# EAGLE design ATTINY85 Updated Design Extended Board (EAGLE 8.4.0)
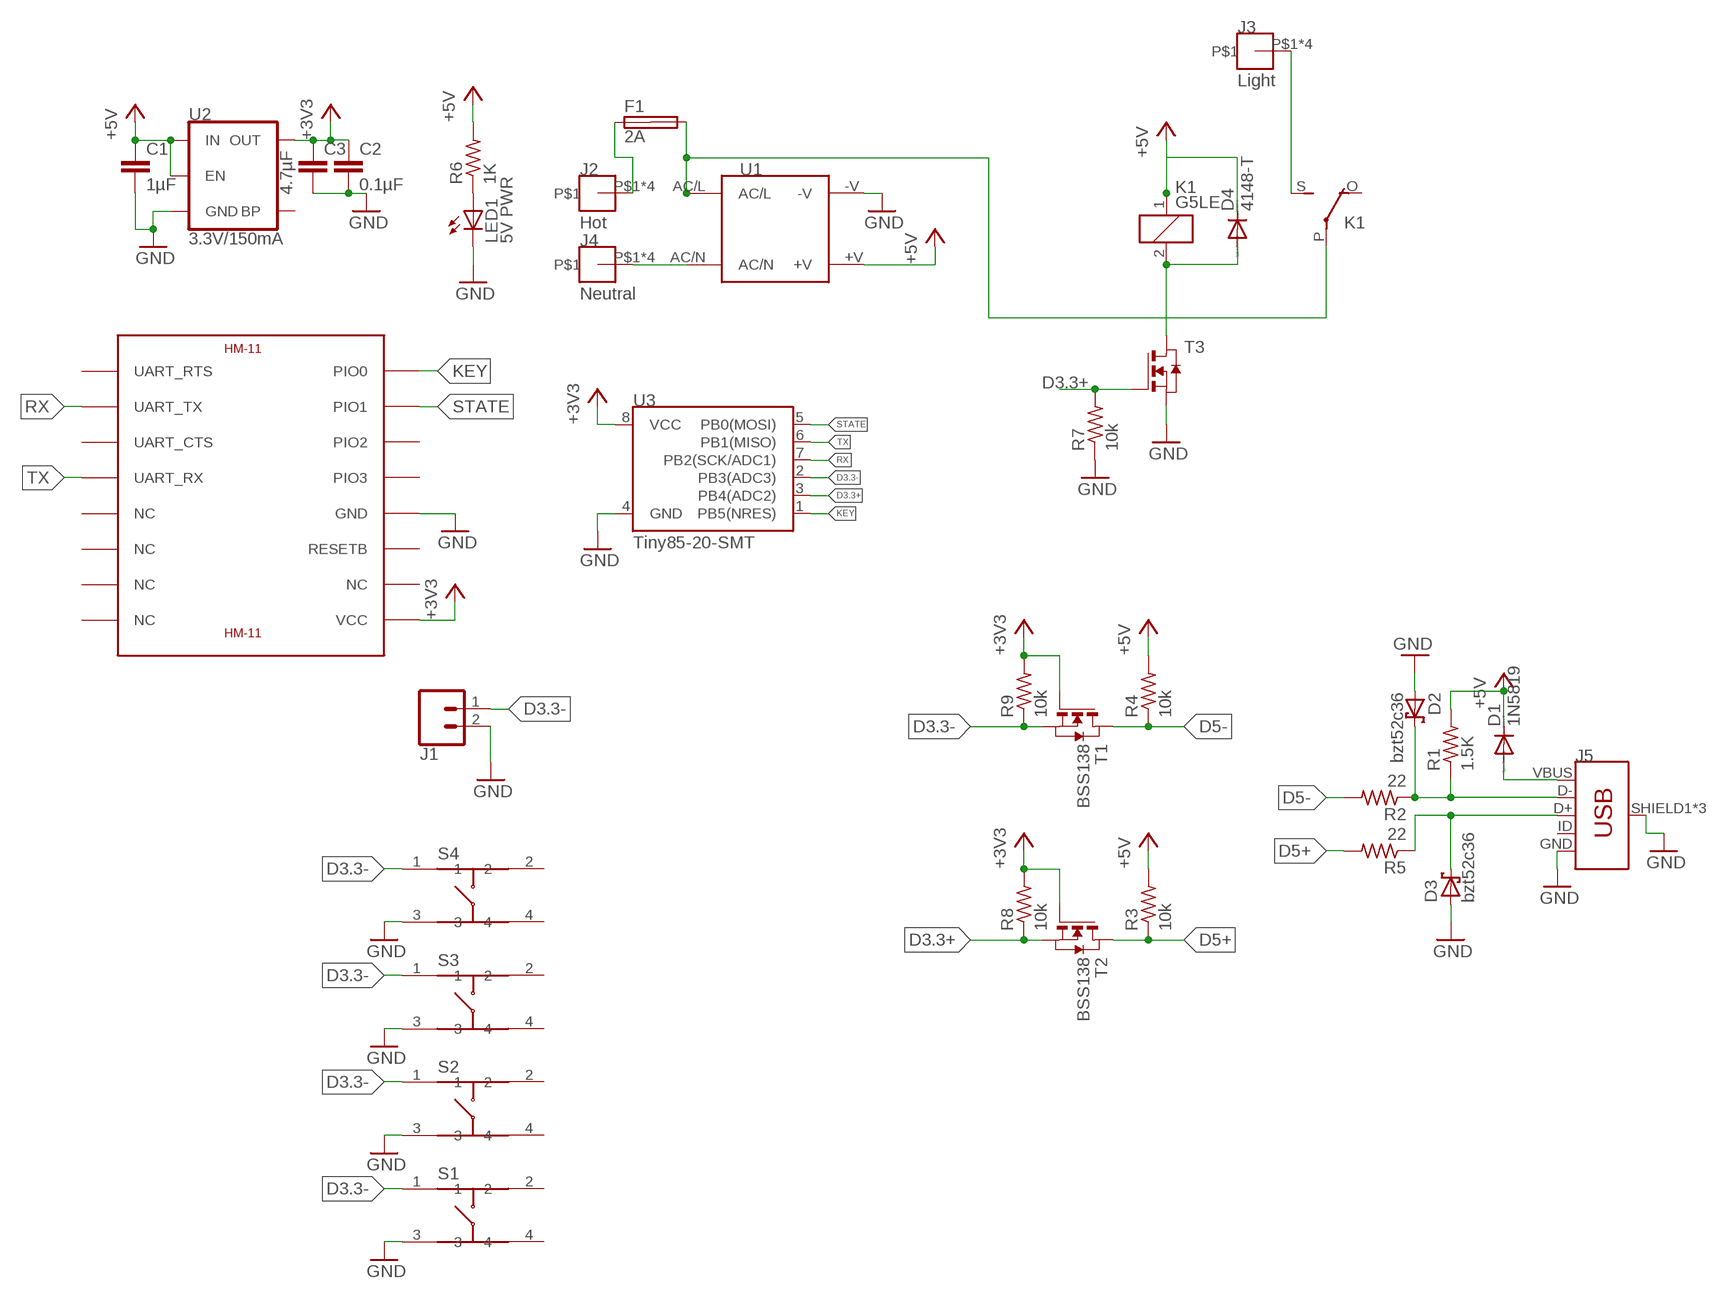
[diagram p0: schematic, sheet 1]

## Parts
C1  1µF  C-EUC0603K  [C0603K]
C2  0.1µF  C-EUC0603K  [C0603K]
C3  4.7µF  C-EUC0603K  [C0603K]
D1  1N5819  DIODE-SOD323-R  [SOD323-R]
D2  bzt52c36  BAT60J  [SOD323_ST]
D3  bzt52c36  BAT60J  [SOD323_ST]
D4  4148-T  DIODE-SOD80C  [SOD80C]
F1  2A  SHK20L  [SHK20L]
J1  CONN_025MM  [SCREWTERMINAL-5MM-2]
J2  Hot  7700  [7700]
J3  Light  7700  [7700]
J4  Neutral  7700  [7700]
J5  USB_MICRO-B_FEMALE-SMT  [USB-B-MICRO-SMD]
K1  G5LE  [G5LE]
LED1  5V PWR  LEDCHIPLED_0603  [CHIPLED_0603]
R1  1.5K  R-US_R0603  [R0603]
R2  22  R-US_R0603  [R0603]
R3  10k  R-US_R0603  [R0603]
R4  10k  R-US_R0603  [R0603]
R5  22  R-US_R0603  [R0603]
R6  1K  R-US_R0603  [R0603]
R7  10k  R-US_R0603  [R0603]
R8  10k  R-US_R0603  [R0603]
R9  10k  R-US_R0603  [R0603]
S1  PTS645S_SMTR92  [SMT]
S2  PTS645S_SMTR92  [SMT]
S3  PTS645S_SMTR92  [SMT]
S4  PTS645S_SMTR92  [SMT]
T1  BSS138  NMOSSOT23  [SOT-23]
T2  BSS138  NMOSSOT23  [SOT-23]
T3  NMOSSOT23  [SOT-23]
U1  IRM-05-5  [IRM-05]
U2  3.3V/150mA  V_REG_MIC52053.3V  [SOT23-5]
U3  Tiny85-20-SMT  ATTINY45TINY85-20-SMT  [SO08-EIAJ_MCU]
U$1  HM-11  [HM-11]

## Nets
+3V3: C2.1 C3.1 R8.2 R9.2 T1.3(G) T2.3(G) U2.5(OUT) U3.8(VCC) U$1.VCC
+5V: C1.1 D1.C D4.C K1.1 R1.2 R3.2 R4.2 R6.2 U1.+V U2.1(IN) U2.3(EN)
D3.3+: R7.2 R8.1 T2.2(S) T3.3(G) U3.3(PB4(ADC2))
D3.3-: J1.1 R9.1 S1.1 S2.1 S3.1 S4.1 T1.2(S) U3.2(PB3(ADC3))
D5+: R3.1 R5.2 T2.1(D)
D5-: R2.2 R4.1 T1.1(D)
GND: C1.2 C2.2 C3.2 D2.A D3.A J1.2 J5.GND J5.SHIELD1(SHIELD) J5.SHIELD2(SHIELD) J5.SHIELD3(SHIELD) LED1.C R7.1 S1.3 S2.3 S3.3 S4.3 T3.2(S) U1.-V U2.2(GND) U3.4(GND) U$1.GND
HOT [POWER]: F1.1A J2.P$1 J2.P$2 J2.P$3 J2.P$4
KEY: U3.1(PB5(NRES)) U$1.PIO0
LIGHT [POWER]: J3.P$1 J3.P$2 J3.P$3 J3.P$4 K1.S(2:S)
N$2: LED1.A R6.1
N$4 [POWER]: F1.2A K1.P(2:P) U1.AC/L
N$8: D4.A K1.2 T3.1(D)
N$16: D1.A J5.VBUS
N$17: D2.C J5.D- R1.1 R2.1
N$18: D3.C J5.D+ R5.1
NEUTRAL [POWER]: J4.P$1 J4.P$2 J4.P$3 J4.P$4 U1.AC/N
RX: U3.7(PB2(SCK/ADC1)) U$1.UART_TX
STATE: U3.5(PB0(MOSI)) U$1.PIO1
TX: U3.6(PB1(MISO)) U$1.UART_RX
Unconnected: F1.1B F1.2B J5.ID K1.O(2:O) S1.2 S1.4 S2.2 S2.4 S3.2 S3.4 S4.2 S4.4 U2.4(BP) U$1.NC@5(NC) U$1.NC@6(NC) U$1.NC@7(NC) U$1.NC@8(NC) U$1.NC@10(NC) U$1.PIO2 U$1.PIO3 U$1.RESETB U$1.UART_CTS U$1.UART_RTS

## Library data of the parts
C1-C3 = rcl:C-EU: CAPACITOR, European symbol
D1 D4 = diode:DIODE-: DIODE
D2 D3 = diode:BAT60J: Schottky barrier diode Source: www.st.com, BAT60J.pdf
F1 = fuse:SHK20L: FUSE HOLDER 5 x 20 mm, SH contact, SHH1 Schukat, E1073 Buerklin; OC_FARNELL: unknown; OC_NEWARK: unknown
J1 = SparkFun-Connectors:CONN_02: Multi connection point. Often used as Generic Header-pin footprint for 0.1 inch spaced/style header connections On any of the 0.1 inch spaced packages, you can populate with these: Break Away Headers - Straight <https://www.sparkfun.com/products/116> (PRT-00116) Break Away Male Headers - Right Angle <https://www.sparkfun.com/products/553> (PRT-00553) Female Headers <https://www.sparkfun.com/products/115> (PRT-00115) Break Away Headers - Machine Pin <https://www.sparkfun.com/products/117> (PRT-00117) Break Away Female Headers - Swiss Machine Pin <https://www.sparkfun.com/products/743> (PRT-00743) For SCREWTERMINALS and SPRING TERMINALS visit here: Screw Terimnals on SparkFun.com <https://www.sparkfun.com/search/results?term=Screw+Terminals> (5mm/3.5mm/2.54mm spacing) This device is also useful as a general connection point to wire up your design to another part of your project. Our various solder wires solder well into these plated through hole pads. Hook-Up Wire - Assortment (Stranded, 22 AWG) <https://www.sparkfun.com/products/11375> (PRT-11375) Hook-Up Wire - Assortment (Solid Core, 22 AWG) <https://www.sparkfun.com/products/11367> (PRT-11367) View the entire wire category on our website here <https://www.sparkfun.com/categories/141> Special notes: Molex polarized connector foot print use with: PRT-08233 with associated crimp pins and housings. 2.54_SCREWTERM for use with PRT-10571. 3.5mm Screw Terminal footprints for PRT-08084 5mm Screw Terminal footprints for use with PRT-08432; SF_SKU: PRT-08432
J2-J4 = Screw Terminal Keystone 7700:7700: 15A Screw Terminal Keystone 7700 <http://www.keyelco.com/product.cfm/Horizontal-Screw-Terminals/7700/product_id/1371>
J5 = SparkFun-Connectors_Custom_USB:USB_MICRO-B: USB Type Micro-B Connector Male/female and PTH/SMT variants SparkFun Products: SparkFun microB USB Breakout <https://www.sparkfun.com/products/12035> SparkFun USB microB Plug Breakout <https://www.sparkfun.com/products/10031> SparkFun ESP8266 Thing <https://www.sparkfun.com/products/13231>; PROD_ID: CONN-11752
K1 = relay:G5LE: RELAY 1 x switch, 10 A/120 V AC, 8 A/30 V DC, Omron; OC_FARNELL: unknown; OC_NEWARK: unknown
LED1 = led:LED: LED OSRAM: - CHIPLED LG R971, LG N971, LY N971, LG Q971, LY Q971, LO R971, LY R971 LH N974, LH R974 LS Q976, LO Q976, LY Q976 LO Q996 - Hyper CHIPLED LW Q18S LB Q993, LB Q99A, LB R99A - SideLED LS A670, LO A670, LY A670, LG A670, LP A670 LB A673, LV A673, LT A673, LW A673 LH A674 LY A675 LS A676, LA A676, LO A676, LY A676, LW A676 LS A679, LY A679, LG A679 - Hyper Micro SIDELED® LS Y876, LA Y876, LO Y876, LY Y876 LT Y87S - SmartLED LW L88C, LW L88S LB L89C, LB L89S, LG L890 LS L89K, LO L89K, LY L89K LS L896, LA L896, LO L896, LY L896 - TOPLED LS T670, LO T670, LY T670, LG T670, LP T670 LSG T670, LSP T670, LSY T670, LOP T670, LYG T670 LG T671, LOG T671, LSG T671 LB T673, LV T673, LT T673, LW T673 LH T674 LS T676, LA T676, LO T676, LY T676, LB T676, LH T676, LSB T676, LW T676 LB T67C, LV T67C, LT T67C, LS T67K, LO T67K, LY T67K, LW E67C LS E67B, LA E67B, LO E67B, LY E67B, LB E67C, LV E67C, LT E67C LW T67C LS T679, LY T679, LG T679 LS T770, LO T770, LY T770, LG T770, LP T770 LB T773, LV T773, LT T773, LW T773 LH T774 LS E675, LA E675, LY E675, LS T675 LS T776, LA T776, LO T776, LY T776, LB T776 LHGB T686 LT T68C, LB T68C - Hyper Mini TOPLED® LB M676 - Mini TOPLED Santana® LG M470 LS M47K, LO M47K, LY M47K Source: http://www.osram.convergy.de LUXEON: - LUMILED® LXK2-PW12-R00, LXK2-PW12-S00, LXK2-PW14-U00, LXK2-PW14-V00 LXK2-PM12-R00, LXK2-PM12-S00, LXK2-PM14-U00 LXK2-PE12-Q00, LXK2-PE12-R00, LXK2-PE12-S00, LXK2-PE14-T00, LXK2-PE14-U00 LXK2-PB12-K00, LXK2-PB12-L00, LXK2-PB12-M00, LXK2-PB14-N00, LXK2-PB14-P00, LXK2-PB14-Q00 LXK2-PR12-L00, LXK2-PR12-M00, LXK2-PR14-Q00, LXK2-PR14-R00 LXK2-PD12-Q00, LXK2-PD12-R00, LXK2-PD12-S00 LXK2-PH12-R00, LXK2-PH12-S00 LXK2-PL12-P00, LXK2-PL12-Q00, LXK2-PL12-R00 Source: www.luxeon.com KINGBRIGHT: KA-3528ASYC Source: www.kingbright.com
R1-R9 = resistor:R-US_: RESISTOR, American symbol
S1-S4 = PTS645 Series Tactile Switches:PTS645S_SMTR92: Surface Mount PTS645 Series Switch Datasheet <http://www.mouser.com/ds/2/60/-1131575.pdf>
T1-T3 = zetex:NMOSSOT23: MOS FET; OC_FARNELL: unknown; OC_NEWARK: unknown
U1 = IRM-05:IRM-05-5: IRM-05-5 AC to 5VDC Specifications: Manufacturer: Mean Well Input Voltage: 85~264 VAC 120~370 VDC Input Frequency: 47~440 Hz Output Voltage: 5 V Output Current: 1 A IRM-05 Datasheet <http://www.mouser.com/ds/2/260/IRM-05-SPEC-806200.pdf>
U2 = SparkFun-IC-Power:V_REG_MIC5205: V_REG MIC5205 Standard 3.3V, 5V, and Adjustable 150mA LDO voltage regulator in SOT-23 layout. Micrel part MIC5205. BP (by-pass) pin is used to lower output noise with 470pF cap, may be left open. On the adjustable version BP is used to set output.; PROD_ID: VREG-00822
U3 = SparkFun-Retired:ATTINY45: Atmel 8-pin 2/4/8kB flash uC Retired; PROD_ID: IC-09092
U$1 = hm-11:HM-11: JNHuaMao HM-11 Bluetooth 4.0 Transceiver based on TI CC2540/CC2541

## Net classes
0 default: clearance 0.152 mm
1 POWER: width 1.397 mm, clearance 1.27 mm

## Board
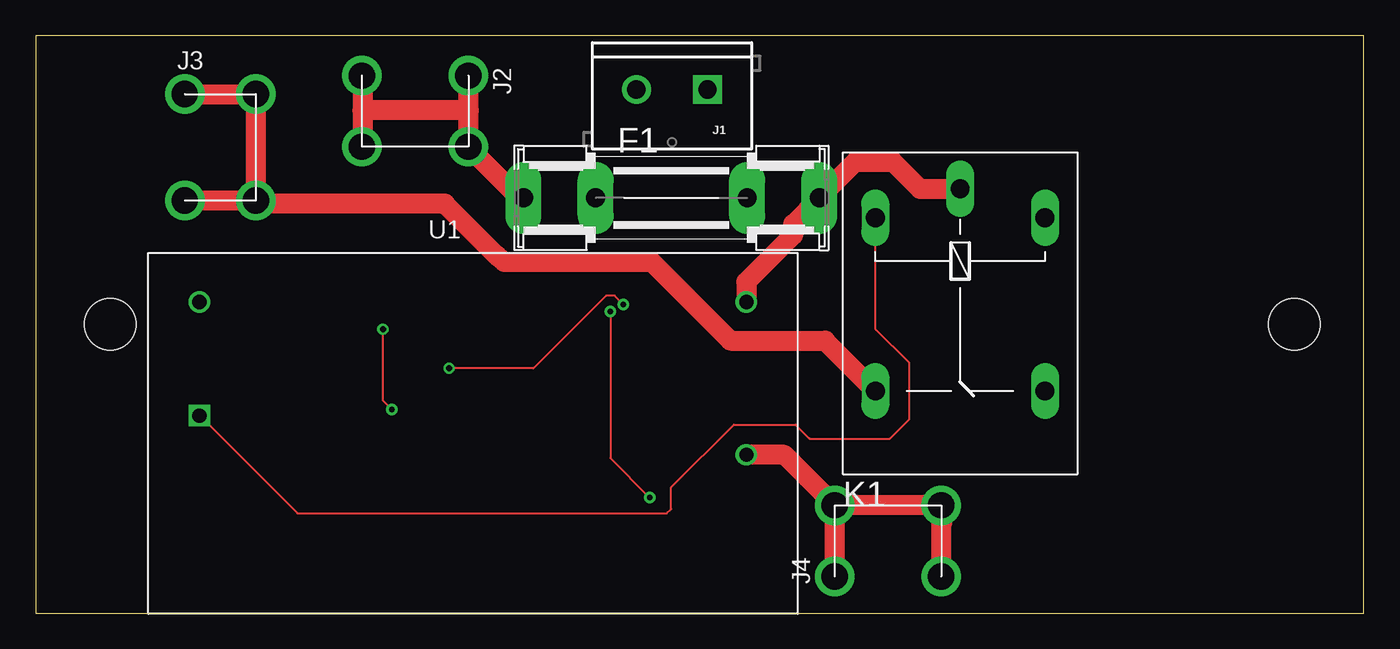
[diagram p1: board, top side]
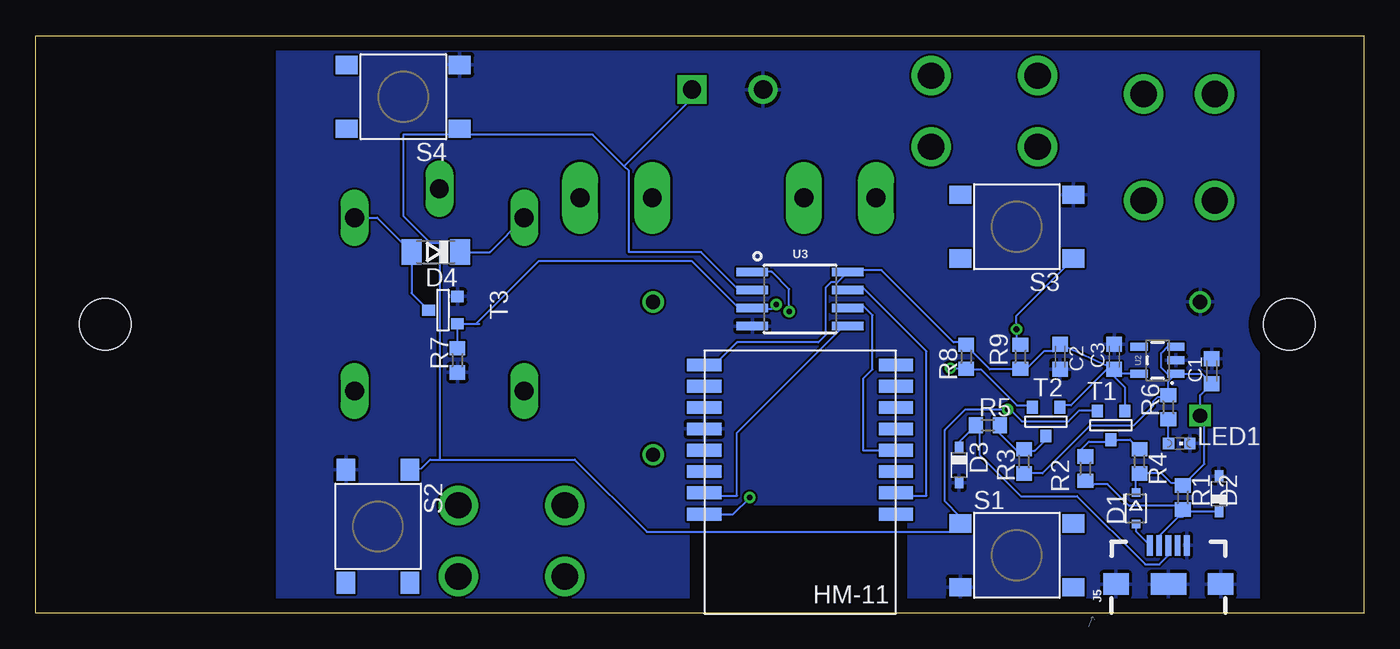
[diagram p2: board, bottom side, seen from below]

Size 93.5 x 40.63 mm. Coordinates in mm from the lower left corner, seen from the top.
Outline: 0,0 93.5,0 93.5,40.63 0,40.63 0,0
Copper layers (1*16): Top 0.035mm / dielectric 1.5mm / Bottom 0.035mm
Design rules "default *": minimum track width 6mil, minimum drill 0.4mm, track to track 6mil, track to pad 6mil, pad to pad 6mil, via to via 6mil, smd to smd 6mil, copper to edge 40mil, drill to drill 6mil, minimum pad ring 10mil, minimum via ring 8mil, stop-mask expansion 4mil, vias tented up to drill 0mil, thermal gap 10mil
Holes 3.66 mm at 88.6,20.32 5.26,20.32

### Footprints (pad centres in the part's own frame; a part is rotated, then mirrored left to right if it is on the bottom)
C0603K = smd 1.05 x 1.08: 1 -0.875,0; 2 0.875,0
SOD323-R = smd 0.6 x 0.6: A 1.1,0; C -1.1,0
SOD323_ST = smd 0.8 x 0.6: A 1.25,0; C -1.25,0
SOD80C = smd 1.4 x 1.8: A 1.7,0; C -1.7,0
SHK20L = drill 1.321 pad 2.54 long: 1A -10.414,0; 1B -5.334,0; 2A 10.414,0; 2B 5.334,0
SCREWTERMINAL-5MM-2 = drill 1.3 pad 2.032 square: 1 0,0 | drill 1.3 pad 2.032: 2 5,0
7700 = drill 1.85: P$1 -2.5,3.745; P$2 2.5,3.745; P$3 -2.5,-3.745; P$4 2.5,-3.745
USB-B-MICRO-SMD = smd 1.45 x 0.4: D+ 2.725,0; D- 2.725,0.65; GND 2.725,-1.3; ID 2.725,-0.65; VBUS 2.725,1.3 | smd 1.5 x 1.8: SHIELD1 0,3.685; SHIELD2 0,-3.685 | smd 1.5 x 2.5: SHIELD3 0,0
G5LE = drill 1.321 long: 1 -7.493,-5.969; 2 -7.493,5.969; O 4.699,5.969; P -9.525,0; S 4.699,-5.969
CHIPLED_0603 = smd 0.8 x 0.8: A 0,-0.75; C 0,0.75
R0603 = smd 1 x 1.1: 1 -0.85,0; 2 0.85,0
SMT = smd 1.55 x 1.3: 1 -3.975,2.25; 2 3.975,2.25; 3 -3.975,-2.25; 4 3.975,-2.25
SOT-23 = smd 0.787 x 0.889: 1 0.025,-1.016; 2 -0.94,1.016; 3 0.991,1.016
IRM-05 = drill 1 square: +V -19.25,-2.625 | drill 1: -V -19.25,5.375; AC/L 19.25,5.375; AC/N 19.25,-5.375
SOT23-5 = smd 0.55 x 1.2: 1 -0.95,-1.3; 2 0,-1.3; 3 0.95,-1.3; 4 0.95,1.3; 5 -0.95,1.3
SO08-EIAJ_MCU = smd 0.61 x 2.21: 1 -1.905,-3.378; 2 -0.635,-3.378; 3 0.635,-3.378; 4 1.905,-3.378; 5 1.905,3.353; 6 0.635,3.353; 7 -0.635,3.353; 8 -1.905,3.353
HM-11 = smd 2.4 x 0.9: GND 6.5,0; NC@5 -7,0; NC@6 -7,-1.5; NC@7 -7,-3; NC@8 -7,-4.5; NC@10 6.5,-3; PIO0 6.5,6; PIO1 6.5,4.5; PIO2 6.5,3; PIO3 6.5,1.5; RESETB 6.5,-1.5; UART_CTS -7,3; UART_RTS -7,6; UART_RX -7,1.5; UART_TX -7,4.5; VCC 6.5,-4.5

### Placement (x,y rotation side)
C1  10.72,17.02 90 bottom
C2  21.39,18.03 270 bottom
C3  17.58,18.03 90 bottom
D1  16.05,7.37 270 bottom
D2  10.21,8.38 90 bottom
D3  28.5,10.41 270 bottom
D4  65.33,25.4 180 bottom
F1  44.75,29.21 0 top
J1  47.29,36.83 180 top
J2  26.72,35.31 270 top
J3  13,32.77 0 top
J4  59.99,5.08 90 top
J5  13.77,2.03 90 bottom
K1  65.07,20.32 270 top
LED1  13,11.94 270 bottom
R1  12.75,8.13 90 bottom
R2  19.61,10.16 90 bottom
R3  23.93,10.67 270 bottom
R4  15.8,10.67 270 bottom
R5  26.47,13.21 0 bottom
R6  13.77,14.48 90 bottom
R7  63.8,17.78 90 bottom
R8  27.99,18.03 90 bottom
R9  24.18,18.03 270 bottom
S1  24.43,4.06 0 bottom
S2  69.39,6.1 270 bottom
S3  24.43,27.18 180 bottom
S4  67.61,36.32 180 bottom
T1  17.83,13.21 0 bottom
T2  22.4,13.46 0 bottom
T3  64.82,21.34 270 bottom
U1  30.78,16.51 0 top
U2  14.53,17.78 90 bottom
U3  39.67,22.1 270 bottom
U$1  39.93,12.95 180 bottom

### Tracks (layer width: path | path; a pad name or v marks a point on that pad's centre or on a via)
+3V3
  Bottom 0.152: U2.5 17.25,16.83 C3.1 | C3.1 C2.1 21.89,18.41 22.53,18.41 23.8,17.14 R9.2 24.43,17.14 26.34,17.14 27.61,18.41 R8.2 28.24,19.05 28.88,19.05 33.96,24.13 35.86,24.13 U3.8 | 18.08,17.14 16.81,15.88 16.81,14.61 T1.3 | 18.08,17.14 20.62,14.61 21.26,14.61 T2.3 | 18.08,17.14 C3.1 | 37.13,24.13 36.5,24.13 U3.8 | U$1.VCC 46.02,17.78 45.39,17.78 44.12,19.05 38.4,19.05 37.9,19.56 37.9,22.89 37.52,23.27 37.06,23.27 U3.8
+5V
  Top 0.152: K1.1 59.13,27.81 59.13,19.96 61.49,17.6 61.49,13.64 60.12,12.27 54.48,12.27 53.49,13.26 49.15,13.26 44.73,8.84 44.73,7.32 44.42,7.01 18.44,7.01 11.58,13.87 U1.+V
  Bottom 0.152: D4.C 61.52,25.4 K1.1 | U2.1 11.41,16.83 C1.1 11.53,15.33 U1.+V 11.23,13.58 11.23,10.5 R1.2 12.8,8.99 12.95,9.14 13.56,9.14 14.25,9.83 15.77,9.83 R4.2 15.85,9.75 16.08,9.53 16.08,8.53 D1.C | U2.1 13.83,16.83 14.27,17.27 14.27,18.29 13.77,18.8 13.29,18.8 U2.3 | U2.1 13.77,16.29 R6.2 13.79,15.32 13.94,15.16 14.55,15.16 14.86,14.86 14.86,14.55 16.23,13.18 19.28,13.18 22.63,9.83 R3.2
D3.3+  (via drill 0.4)
  Top 0.152: v29.11,17.22 35.05,17.22 40.16,22.33 40.77,22.33 v41.38,21.72
  Bottom 0.152: R7.2 T3.3 62.53,20.34 | 62.53,20.34 62.26,20.34 | T2.2 23.16,14.61 24.43,14.61 26.97,17.14 27.61,17.14 R8.1 28.04,17.22 v29.11,17.22 | 44.12,21.59 47.29,24.77 58.09,24.77 62.53,20.32 62.53,20.34 | 44.12,21.59 43.48,21.59 U3.3 | 44.12,21.59 U3.3 | v41.38,21.72 41.68,21.41 43.05,21.41 U3.3
D3.3-  (via drill 0.4)
  Top 0.152: v24.46,19.96 24.46,14.94 v25.07,14.33
  Bottom 0.152: 65.07,10.79 65.71,10.79 66.34,10.16 S2.1 | 65.07,10.79 55.55,10.79 50.47,5.71 28.88,5.71 S1.1 28.42,6.33 28.42,6.78 29.49,7.85 29.49,12.88 28.04,14.33 v25.07,14.33 24.99,14.4 24.08,13.49 20.8,13.49 20.04,14.25 18.82,14.25 T1.2 18.72,14.29 | R9.1 24.43,19.05 24.43,19.96 v24.46,19.96 24.46,20.93 S3.1 | 52.07,31.45 51.74,31.11 51.74,25.4 46.66,25.4 44.12,22.86 43.48,22.86 U3.2 42.85,22.86 | 52.07,31.45 54.28,33.66 63.17,33.66 S4.1 63.8,33.66 67.61,33.66 67.61,27.94 65.71,26.04 65.07,26.04 65.07,10.79 | 52.07,31.45 47.32,36.2 47.32,36.8 J1.1
D5+
  Bottom 0.152: T2.1 22.53,12.06 23.16,11.43 23.8,11.43 R3.1 24.43,11.43 25.7,12.7 R5.2
D5-
  Bottom 0.152: T1.1 18.08,12.06 19.35,12.06 19.99,11.43 R2.2 | 15.54,11.43 R4.1 16.47,12.19 T1.1 | 17.45,12.06 T1.1
GND
  pour Bottom: 75.49,41.91 7.92,41.91 7.42,40.39 7.42,-0.25 7.67,-1.52 31.8,-1.52 32.05,-1.27 32.05,7.62 47.29,7.62 47.55,7.37 47.55,-1.27 73.96,-1.27 74.98,-0.25 75.49,-0.25 76.5,0.76 76.5,41.4 76,41.4
HOT
  Top 1.397: 23.01,35.36 23.01,37.8 J2.P$3 | 23.01,35.36 23.01,32.84 J2.P$4 | F1.1A 34.29,29.26 33.98,29.26 30.48,32.77 J2.P$2 30.48,33.45 30.48,35.36 | 30.48,35.36 30.48,37.8 J2.P$1 | 30.48,35.36 23.01,35.36
KEY  (via drill 0.4)
  Top 0.152: v43.23,8.13 40.46,10.9 v40.46,21.21
  Bottom 0.152: 46.02,6.99 U$1.PIO0 44.4,6.95 v43.23,8.13 | U3.1 41.68,24 40.46,22.78 v40.46,21.21
LIGHT
  Top 1.397: J3.P$4 J3.P$3 | J3.P$1 J3.P$2 J3.P$4 | K1.S 55.56,19.16 48.91,19.16 43.37,24.7 33,24.7 32.46,25.15 28.8,28.8 16.15,28.8 J3.P$4
N$2
  Bottom 0.152: LED1.A 13.75,13.62 R6.1
N$4
  Top 1.397: U1.AC/L 50.03,23.31 53.33,26.6 53.33,27.37 F1.2A 57.72,31.76 60.33,31.76 62.25,29.84 K1.P
N$8
  Bottom 0.152: K1.2 69.44,27.81 D4.A 67.03,22.5 T3.1
N$16
  Bottom 0.152: D1.A 16.05,5.74 J5.VBUS
N$17
  Bottom 0.152: 19.35,8.89 R2.1 19.35,8.99 19.05,8.99 18.97,9.07 18.06,9.07 16.54,7.54 13.03,7.54 12.8,7.32 R1.1 | D2.C 10.21,7.16 12.65,7.16 12.73,7.24 R1.1 | R1.1 12.73,7.16 12.73,6.78 13.08,6.78 14.42,5.45 J5.D-
N$18
  Bottom 0.152: D3.C 28.48,11.66 28.24,11.43 D3.C | D3.C 28.26,11.66 | R5.1 27.61,12.7 | D3.C 28.5,12.03 R5.1 | R5.1 27.36,13.03 27.05,12.72 27.05,11.12 24.16,8.23 20.19,8.23 15.39,3.43 14.4,3.43 13.77,4.06 J5.D+
NEUTRAL
  Top 1.397: J4.P$2 52.69,11.13 U1.AC/N | J4.P$2 J4.P$4 63.8,7.51 63.8,6.35 63.74,6.29 J4.P$3 | J4.P$1 J4.P$2
RX
  Bottom 0.152: U3.7 35.86,22.86 35.23,22.86 30.78,18.41 30.78,8.26 32.69,8.26 U$1.UART_TX
STATE
  Bottom 0.152: U3.5 36.5,20.32 44.12,12.7 44.12,8.26 46.02,8.26 U$1.PIO1
TX
  Bottom 0.152: U3.6 35.86,21.59 35.23,21.59 34.59,20.95 34.59,17.14 35.23,16.51 35.23,11.43 33.32,11.43 U$1.UART_RX